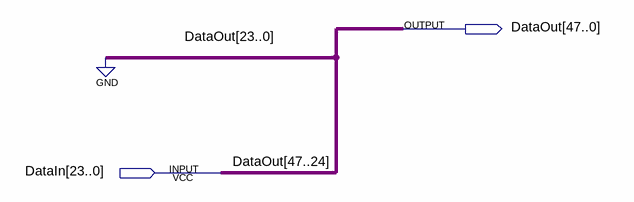
[diagram p0: schematic sheet]
// Quartus schematic ExtendedDivisor.bdf as structural Verilog: 0 symbols, 2 pins
module ExtendedDivisor (
  input  [23:0] DataIn,
  output [47:0] DataOut
);


  assign DataOut = {DataIn, {24{1'b0}}};
endmodule
